# Altium schematic sheet DASH_V_3_STM_CAN.SchDoc
size A
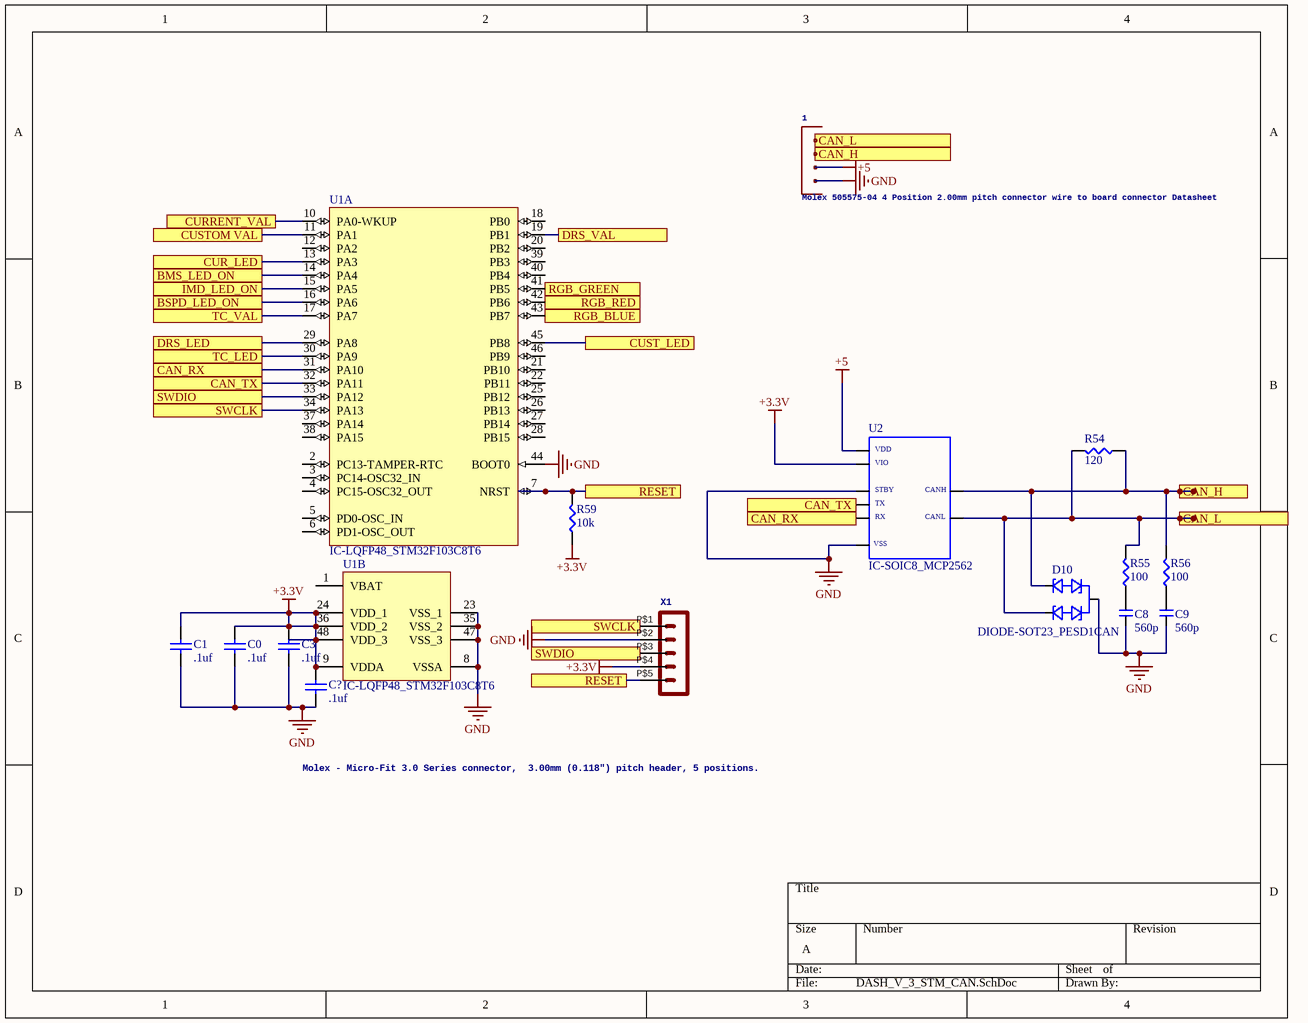
[diagram p0: DASH_V_3_STM_CAN.SchDoc]

## Parts
1  Molex 505575-04 4 Position 2.00mm pitch connector wire to board connector Datasheet  [505575-04]
C0  .1uf  [CAPC1608X87X35NL15T15]
C1  .1uf  [CAPC1608X87X35NL15T15]
C3  .1uf  [CAPC1608X87X35NL15T15]
C8  560p  [CAP-0603]
C9  560p  [CAP-0603]
C?  .1uf  [CAPC1608X87X35NL15T15]
D10  DIODE-SOT23_PESD1CAN  [SOT23]
R54  120  [RES-0603]
R55  100  [RES-0603]
R56  100  [RES-0603]
R59  10k  [RES-0603]
U1  IC-LQFP48_STM32F103C8T6  [STM-LQFP48_M]  (parts A,B of 2)
U2  IC-SOIC8_MCP2562  [SOIC8]
X1  Molex - Micro-Fit 3.0 Series connector,  3.00mm (0.118") pitch header, 5 positions.  [POS5_254MM_MALE]

## Ports
BMS_LED_ON, BSPD_LED_ON, CAN_H, CAN_L, CAN_RX, CAN_TX, CUR_LED, CURRENT_VAL, CUST_LED, CUSTOM VAL, DRS_LED, DRS_VAL, IMD_LED_ON, RESET, RGB_BLUE, RGB_GREEN, RGB_RED, SWCLK, SWDIO, TC_LED, TC_VAL

## Nets
+3.3V: C0.2 C1.2 C3.2 C?.2 R59.1 U1.9(VDDA) U1.24(VDD_1) U1.36(VDD_2) U1.48(VDD_3) U2.5 X1.P$4
+5: 1.3 U2.3
GND: 1.4 C0.1 C1.1 C3.1 C8.1 C9.1 C?.1 D10.3(G) U1.8(VSSA) U1.23(VSS_1) U1.35(VSS_2) U1.44(BOOT0) U1.47(VSS_3) U2.2 U2.8 X1.P$2
BMS_LED_ON: U1.14(PA4) ; port BMS_LED_ON
BSPD_LED_ON: U1.16(PA6) ; port BSPD_LED_ON
CAN_H: 1.2 D10.1(CAN1) R54.1 R56.2 U2.7 ; port CAN_H
CAN_L: 1.1 D10.2(CAN2) R54.2 R55.2 U2.6 ; port CAN_L
CAN_RX: U1.31(PA10) U2.4 ; port CAN_RX
CAN_TX: U1.32(PA11) U2.1 ; port CAN_TX
CUR_LED: U1.13(PA3) ; port CUR_LED
CURRENT_VAL: U1.10(PA0-WKUP) ; port CURRENT_VAL
CUST_LED: U1.45(PB8) ; port CUST_LED
CUSTOM VAL: U1.11(PA1) ; port CUSTOM VAL
DRS_LED: U1.29(PA8) ; port DRS_LED
DRS_VAL: U1.19(PB1) ; port DRS_VAL
IMD_LED_ON: U1.15(PA5) ; port IMD_LED_ON
RESET: R59.2 U1.7(NRST) X1.P$5 ; port RESET
RGB_BLUE: U1.43(PB7) ; port RGB_BLUE
RGB_GREEN: U1.41(PB5) ; port RGB_GREEN
RGB_RED: U1.42(PB6) ; port RGB_RED
SWCLK: U1.34(PA13) X1.P$1 ; port SWCLK
SWDIO: U1.33(PA12) X1.P$3 ; port SWDIO
TC_LED: U1.30(PA9) ; port TC_LED
TC_VAL: U1.17(PA7) ; port TC_VAL
NetC8_2: C8.2 R55.1
NetC9_2: C9.2 R56.1

Not connected (* = marked no-connect by the designer): U1 1(VBAT) 2(PC13-TAMPER-RTC) 3(PC14-OSC32_IN) 4(PC15-OSC32_OUT) 5(PD0-OSC_IN) 6(PD1-OSC_OUT) 12(PA2) 18(PB0) 20(PB2) 21(PB10) 22(PB11) 25(PB12) 26(PB13) 27(PB14) 28(PB15) 37(PA14) 38(PA15) 39(PB3) 40(PB4) 46(PB9)

## Notes on the sheet
- (in symbol IC-SOIC8_MCP2562) VDD; VIO; STBY; CANH; TX; RX; CANL; VSS

## Library data of the parts
1 = 505575-04: GateName_1: G$1; SymbolName_1: 4POS; LibraryName: MOLEX Micro-Lock; DeviceSetName: 505575-04; Package: 505575-04
C0 C1 C3 C? = CMP-2006-03887-1: .1 uf; Part Number: C0603C104J3RAC7867; Manufacturer: Kemet
C8 C9 = CAP-0603
R54-R56 R59 = RES-0603
U1 = IC-LQFP48_STM32F103C8T6: A/D Converter: 2x12-bit (10 Channel); Core: ARM Cortex-M3; FLASH Size (Prog) (kB): 64; I/Os (High Current): 37; Internal RAM Size (kB): 20; Operating Frequency(F) (Processor speed) (MHz): 72; Packing: Tray; Supply Voltage(Vcc) min (V): 2; DatasheetVersion: Rev. 16; PackageVersion: Rev. 6, 06/2013; PackageReference: LQFP48; PackageDescription: 48-Pin Low Profile Quad Flat Package, 7 x 7 mm Body, 0.5 mm Pitch; Supplier 1: Digi-Key; Supplier Part Number 1: 497-6063-ND; Supplier 2: Farnell; Supplier Part Number 2: 1447637; Supplier 3: Newark; Supplier Part Number 3: 59M2182; Supplier 4: Newark; Supplier Part Number 4: 57P1222; Supplier 5: Mouser; Supplier Part Number 5: 511-STM32F103C8T6; Mounting Technology: Surface Mount; PartNumber: STM32F103C8T6; ComponentLink1Description: Manufacturer URL; ComponentLink1URL: http://www.st.com/web/en/home.html; ComponentLink2Description: Datasheet; ComponentLink2URL: http://www.st.com/st-web-ui/static/active/en/resource/technical/document/datasheet/CD00161566.pdf; ComponentLink3Description: Package Specification; ComponentLink3URL: http://www.st.com/st-web-ui/static/active/en/resource/technical/document/datasheet/DM00058181.pdf
X1 = POS5_254MM_MALE: GateName_1: G$1; SymbolName_1: HEADER_POS5; DeviceName: 43650-0524; DeviceSetName: HEADER_POS5_?; LibraryName: MOLEX Micro-Fit; Package: 43650-0524